# EAGLE design Kortex_Agro (EAGLE 9.3.0)

## Sheet 1 of 2
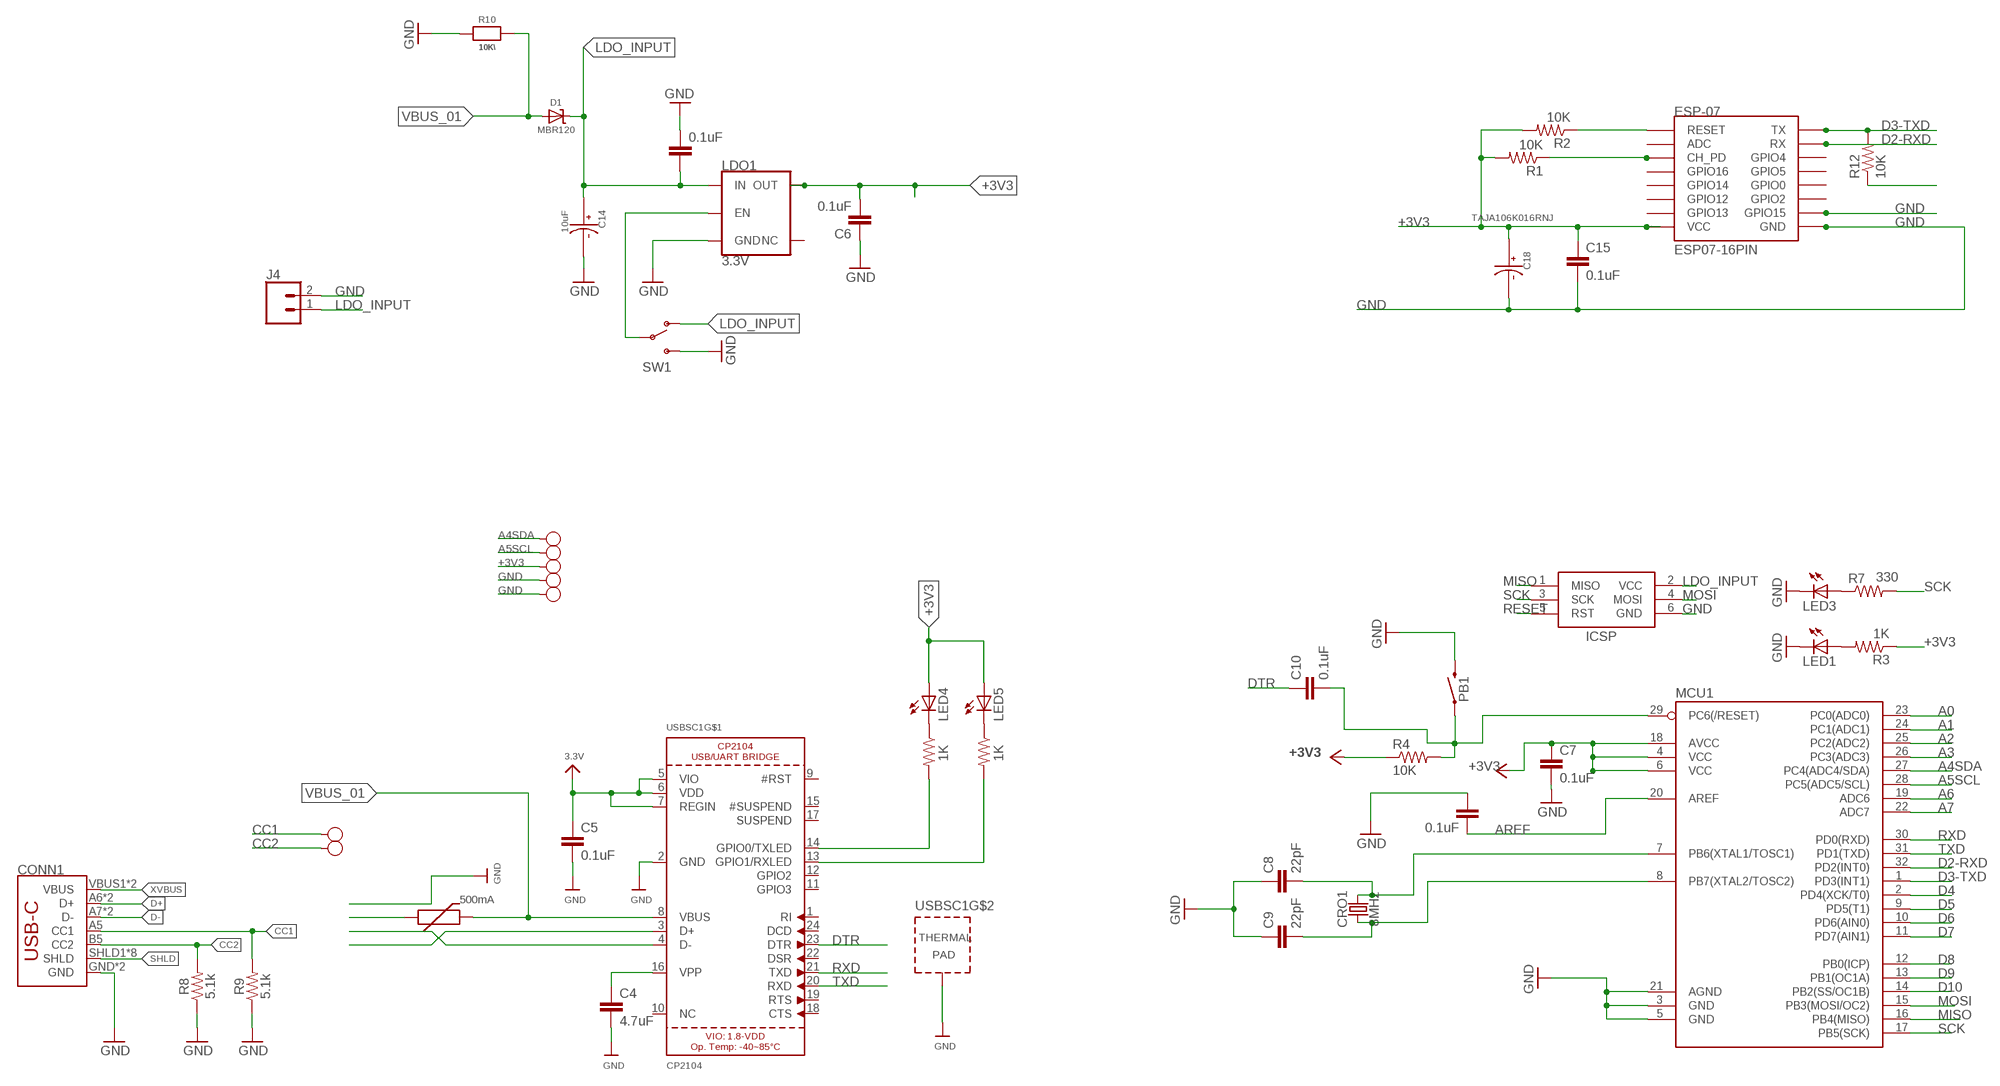
[diagram p0: schematic, sheet 1, part 1 of 2]
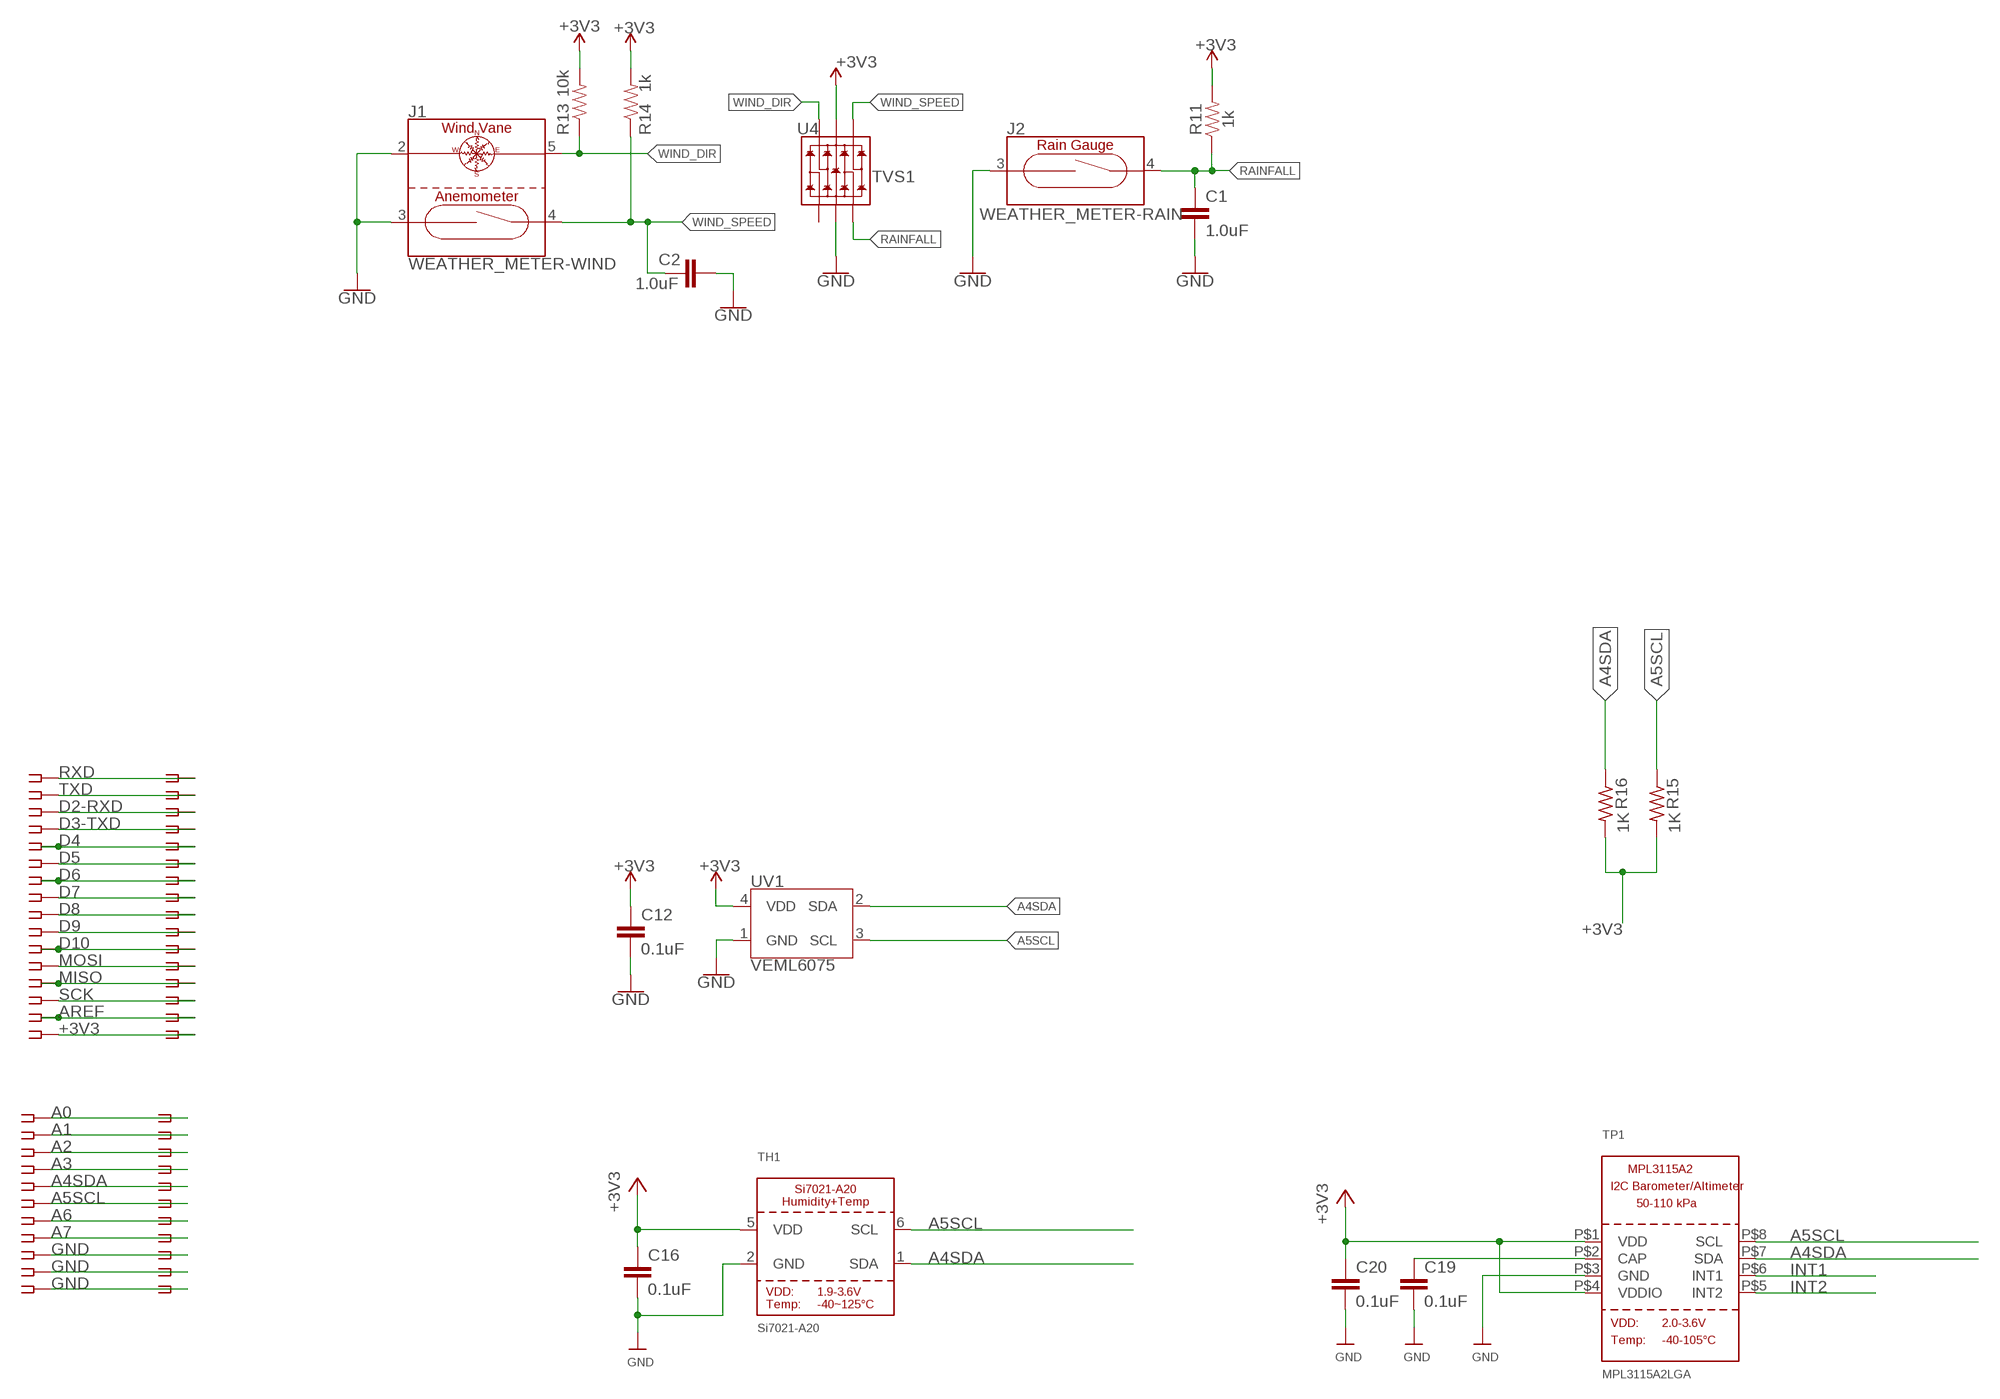
[diagram p1: schematic, sheet 1, part 2 of 2]

### Parts
+3.3V  +3V3  TEST-POINT'4545'  [TP-D45MIL]
C1  1.0uF  1.0UF-0603-16V-10%  [0603]
C2  1.0uF  1.0UF-0603-16V-10%  [0603]
C3  0.1uF  22UF-0805-6.3V-20%  [0805]
C4  4.7uF  22UF-0805-6.3V-20%  [0805]
C5  0.1uF  22UF-0805-6.3V-20%  [0805]
C6  0.1uF  22UF-0805-6.3V-20%  [0805]
C7  0.1uF  22UF-0805-6.3V-20%  [0805]
C8  22pF  22UF-0805-6.3V-20%  [0805]
C9  22pF  22UF-0805-6.3V-20%  [0805]
C10  0.1uF  22UF-0805-6.3V-20%  [0805]
C11  0.1uF  22UF-0805-6.3V-20%  [0805]
C12  0.1uF  0.1UF-0603-25V-(+80/-20%)  [0603]
C14  10uF  TAJA106K016RNJ  [CAPMP3216X166]
C15  0.1uF  CAP0805  [0805]
C16  0.1uF  CAP0805  [0805]
C18  TAJA106K016RNJ  [CAPMP3216X166]
C19  0.1uF  CAP0805  [0805]
C20  0.1uF  CAP0805  [0805]
CONN1  USB_C16PIN  [USB-C-16P]
CRO1  8MHz  CRYSTAL-8MHZSMD-5X3.2  [CRYSTAL-SMD-5X3.2-4PAD]
D1  MBR120  DIODE-SCHOTTKYSOD-123  [SOD-123]
ESP-07  ESP07-16PIN  [ESP07-16PIN]
GND  GND  TEST-POINT'4545'  [TP-D45MIL]
GND13  GND  TEST-POINT'4545'  [TP-D45MIL]
GND21  GND  TEST-POINT'4545'  [TP-D45MIL]
GND22  GND  TEST-POINT'4545'  [TP-D45MIL]
HD1  SSW-116-02-G-D  [SSW-116-02-G-D]
HD2  SSW-111-02-S-D  [SSW-111-02-S-D]
ICSP  AVRISP-6  [AVRISP]
J1  WEATHER_METER-WIND  [RJ11-6]
J2  WEATHER_METER-RAIN  [RJ11-6]
J4  CONN_02  [1X02]
LDO1  3.3V  V_REG_AP2112K-3.3V  [SOT23-5]
LED1  LEDCHIPLED_0805  [CHIPLED_0805]
LED3  LEDCHIPLED_0805  [CHIPLED_0805]
LED4  LEDCHIPLED_0805  [CHIPLED_0805]
LED5  LEDCHIPLED_0805  [CHIPLED_0805]
MCU1  ATMEGA328P_TQFPATMEGA328P-AU  [QFP80P912X912X120-32]
PB1  SWITCH-MOMENTARY-2SMD  [TACTILE_SWITCH_SMD]
PTC1  500mA  PTCSMD  [PTC-1206]
R1  10K  R-US_M0805  [M0805]
R2  10K  R-US_M0805  [M0805]
R3  1K  R-US_M0805  [M0805]
R4  10K  R-US_M0805  [M0805]
R5  1K  R-US_M0805  [M0805]
R6  1K  R-US_M0805  [M0805]
R7  330  R-US_M0805  [M0805]
R8  5.1k  5.1KOHM5.1KOHM-0603-1/10W-1%  [0603]
R9  5.1k  5.1KOHM5.1KOHM-0603-1/10W-1%  [0603]
R10  10K\  RESISTOR0805_NOOUTLINE  [0805-NO]
R11  1k  1KOHM-0603-1/10W-1%  [0603]
R12  10K  R-US_M0805  [M0805]
R13  10k  10KOHM-0603-1/10W-1%  [0603]
R14  1k  1KOHM-0603-1/10W-1%  [0603]
R15  1K  R-US_M0805  [M0805]
R16  1K  R-US_M0805  [M0805]
SCL  SCL  TEST-POINT'4545'  [TP-D45MIL]
SDA  SDA  TEST-POINT'4545'  [TP-D45MIL]
SW1  SWITCH-SPSTSMD  [AYZ0202]
TH1  Si7021-A20  SI7021-A20  [DFN6_3X3_SI]
TP1  MPL3115A2LGA  [LGA8]
U4  TVS1  TVS_DIODE_ARRAYSMD  [SOT-23-6]
USBSC1  CP2104  [QFN24_4MM_SMSC]
UV1  VEML6075  [VEML6075_A3OP]

### Nets
+3V3: +3.3V.T C5.1 C6.2 C7.1 C12.1 C15.1 C16.1 C18.+ C20.1 ESP-07.VCC HD1.31 HD1.32 LDO1.5(OUT) LED4.A LED5.A MCU1.4(VCC) MCU1.6(VCC) MCU1.18(AVCC) R1.2 R2.2 R3.1 R4.1 R11.2 R13.2 R14.2 R15.2 R16.2 TH1.5(VDD) TP1.P$1(VDD) TP1.P$4(VDDIO) U4.5(VCC) USBSC1.5(VIO) USBSC1.6(VDD) USBSC1.7(REGIN) UV1.4(VDD) ; supply symbol labelled 3.3V, +5V
A0: HD2.1 HD2.2 MCU1.23(PC0(ADC0))
A1: HD2.3 HD2.4 MCU1.24(PC1(ADC1))
A2: HD2.5 HD2.6 MCU1.25(PC2(ADC2))
A3: HD2.7 HD2.8 MCU1.26(PC3(ADC3))
A4SDA: HD2.9 HD2.10 MCU1.27(PC4(ADC4/SDA)) R16.1 SDA.T TH1.1(SDA) TP1.P$7(SDA) UV1.2(SDA)
A5SCL: HD2.11 HD2.12 MCU1.28(PC5(ADC5/SCL)) R15.1 SCL.T TH1.6(SCL) TP1.P$8(SCL) UV1.3(SCL)
A6: HD2.13 HD2.14 MCU1.19(ADC6)
A7: HD2.15 HD2.16 MCU1.22(ADC7)
AREF: C11.2 HD1.29 HD1.30 MCU1.20(AREF)
CAP1: C19.1 TP1.P$2(CAP)
CC1: CONN1.A5(CC1) GND21.T R9.2
CC2: CONN1.B5(CC2) GND22.T R8.2
D2-RXD: ESP-07.RX HD1.5 HD1.6 MCU1.32(PD2(INT0))
D3-TXD: ESP-07.TX HD1.7 HD1.8 MCU1.1(PD3(INT1)) R12.2
D4: HD1.9 HD1.10 MCU1.2(PD4(XCK/T0))
D5: HD1.11 HD1.12 MCU1.9(PD5(T1))
D6: HD1.13 HD1.14 MCU1.10(PD6(AIN0))
D7: HD1.15 HD1.16 MCU1.11(PD7(AIN1))
D8: HD1.17 HD1.18 MCU1.12(PB0(ICP))
D9: HD1.19 HD1.20 MCU1.13(PB1(OC1A))
D10: HD1.21 HD1.22 MCU1.14(PB2(SS/OC1B))
D+: CONN1.A6(D+) CONN1.B6(D+) USBSC1.3(D+)
D-: CONN1.A7(D-) CONN1.B7(D-) USBSC1.4(D-)
DTR: C10.1 USBSC1.23(DTR)
GND: C1.2 C2.2 C3.1 C4.2 C5.2 C6.1 C7.2 C8.1 C9.1 C11.1 C12.2 C14.- C15.2 C16.2 C18.- C19.2 C20.2 CONN1.GND CONN1.GND2(GND) ESP-07.GND ESP-07.GPIO15 GND13.T GND.T HD2.17 HD2.18 HD2.19 HD2.20 HD2.21 HD2.22 ICSP.6(GND) J1.2(DIR-1) J1.3(ANN-1) J2.3 J4.2 LDO1.2(GND) LED1.C LED3.C MCU1.3(GND) MCU1.5(GND) MCU1.21(AGND) PB1.3 R8.1 R9.1 R10.1 SW1.3(S) TH1.2(GND) TP1.P$3(GND) U4.2(VSS) USBSC1.2(GND) USBSC1.THERM(TP) UV1.1(GND)
GPIO/0: R6.2 USBSC1.14(GPIO0/TXLED)
GPIO/1: R5.2 USBSC1.13(GPIO1/RXLED)
INT1: TP1.P$6(INT1)
INT2: TP1.P$5(INT2)
LDO_INPUT: C3.2 C14.+ D1.C ICSP.2(VCC) J4.1 LDO1.1(IN) SW1.1(O)
MISO: HD1.25 HD1.26 ICSP.1(MISO) MCU1.16(PB4(MISO))
MOSI: HD1.23 HD1.24 ICSP.4(MOSI) MCU1.15(PB3(MOSI/OC2))
N$1: LED3.A R7.1
N$2: LED1.A R3.2
N$3: ESP-07.CH_PD R1.1
N$5: LED4.C R6.1
N$6: C9.2 CRO1.1 MCU1.8(PB7(XTAL2/TOSC2))
N$7: C8.2 CRO1.3 MCU1.7(PB6(XTAL1/TOSC1))
N$8: LED5.C R5.1
N$10: ESP-07.REST(RESET) R2.1
N$13: C4.1 USBSC1.16(VPP)
N$16: LDO1.3(EN) SW1.2(P)
PPP: R12.1
RAINFALL: C1.1 J2.4 R11.1 U4.3(IO2)
RESET: C10.2 ICSP.5(RST) MCU1.29(PC6(/RESET)) PB1.1 R4.2
RXD: HD1.1 HD1.2 MCU1.30(PD0(RXD)) USBSC1.21(TXD)
SCK: HD1.27 HD1.28 ICSP.3(SCK) MCU1.17(PB5(SCK)) R7.2
SHLD: CONN1.SHLD1(SHLD) CONN1.SHLD2(SHLD) CONN1.SHLD3(SHLD) CONN1.SHLD4(SHLD) CONN1.SHLD5(SHLD) CONN1.SHLD6(SHLD) CONN1.SHLD7(SHLD) CONN1.SHLD8(SHLD)
TXD: HD1.3 HD1.4 MCU1.31(PD1(TXD)) USBSC1.20(RXD)
VBUS_01: D1.A PTC1.2 R10.2 USBSC1.8(VBUS)
WIND_DIR: J1.5(DIR2) R13.1 U4.6(IO4)
WIND_SPEED: C2.1 J1.4(ANN-2) R14.1 U4.4(IO3)
XVBUS: CONN1.VBUS1(VBUS) CONN1.VBUS2(VBUS) PTC1.1
Unconnected: ESP-07.ADC ESP-07.GPIO0 ESP-07.GPIO2 ESP-07.GPIO4 ESP-07.GPIO5 ESP-07.GPIO12 ESP-07.GPIO13 ESP-07.GPIO14 ESP-07.GPIO16 LDO1.4(NC) U4.1(IO1) USBSC1.1(RI) USBSC1.9(#RST) USBSC1.10(NC) USBSC1.11(GPIO3) USBSC1.12(GPIO2) USBSC1.15(#SUSPEND) USBSC1.17(SUSPEND) USBSC1.18(CTS) USBSC1.19(RTS) USBSC1.22(DSR) USBSC1.24(DCD)

### Notes on the sheet
- -LLC:
- -USB/SERIAL:
- -5V.REG:
- -3.3V.REG:
- -OPAMP:
- -USB-CONN:
- -PWR.CONN:
- 500mA

## Sheet 2 of 2

## Library data of the parts
+3.3V GND GND13 GND21 GND22 SCL SDA = Discrete-new:TEST-POINT; PARTNO: DNP
C1 C2 = SparkFun-Capacitors:1.0UF: 1µF ceramic capacitors A capacitor is a passive two-terminal electrical component used to store electrical energy temporarily in an electric field.; PROD_ID: CAP-00868
C3-C11 = SparkFun-Capacitors:22UF: 22µF ceramic capacitors A capacitor is a passive two-terminal electrical component used to store electrical energy temporarily in an electric field.; PROD_ID: CAP-08402; VALUE: 22uF
C12 = SparkFun-Capacitors:0.1UF: 0.1µF ceramic capacitors A capacitor is a passive two-terminal electrical component used to store electrical energy temporarily in an electric field.; PROD_ID: CAP-00810
C14 C18 = TAJA106K016RNJ:TAJA106K016RNJ: Cap Tant Solid 10uF 16V A CASE 10% (3.2 X 1.6 X 1.6mm) SMD 3216-18 3 Ohm 125°C T/R; AVAILABILITY: Good; DESCRIPTION: Cap Tant Solid 10uF 16V A CASE 10% (3.2 X 1.6 X 1.6mm) SMD 3216-18 3 Ohm 125°C T/R; MF: AVX Interconnect / Elco; MP: TAJA106K016RNJ; PACKAGE: 1206 AVX Interconnect / Elco; PRICE: 0.16 USD
C15 = SparkFun:CAP: Capacitor Standard 0603 ceramic capacitor, and 0.1" leaded capacitor.
C16 C19 C20 = SparkFun-Passives:CAP: Capacitor Standard 0603 ceramic capacitor, and 0.1" leaded capacitor.
CONN1 = SparkFun-Connectors:USB_C: USB Type C 16Pin Connector Super Speed pins not available on the 16-pin purely SMD connector so this part is best for USB 2.0 implementations. D1 and D2 are tied together enabling D+/- no matter which way the cable is plugged into the connector. The two channel configuration pins (CC1/2) are exposed. These are normally connected to ground via 5.1k resistors but can be reconfigured for high current/high power applications.; PROD_ID: CONN-14122
CRO1 = SparkFun-Clocks:CRYSTAL-8MHZ: 8MHz Crystal Datasheet Example <http://www.futureelectronics.com/en/technologies/electromechanical/timing-devices/crystals/Pages/6008189-ABM3B-8.000MHZ-B2-T.aspx?IM=0> Frequency: 8MHz Frequency Tolerance: ±20ppm Load Capacitance: 18pF SparkFun Products: Pro Micro -3.3V/8MHz <https://www.sparkfun.com/products/12587> WAV Trigger <https://www.sparkfun.com/products/13660>; PROD_ID: XTAL-09431
D1 = microbuilder:DIODE-SCHOTTKY
ESP-07 = esp8266modules:ESP07-16PIN: ESP8266 Wifi module 07 - 16 pins; DIMENSIONS: 22.0 x 16.0 mm; PINS: 16; PITCH: 0.078" / 2 mm
HD1 = con-samtec:SSW-116-02-G: THROUGH-HOLE .025" SQ POST SOCKET Source: Samtec SSW.pdf; MF: Samtec Inc.; MPN: SSW-116-02-G-D; OC_FARNELL: unknown; OC_NEWARK: 11P9577
HD2 = con-samtec:SSW-111-02-S-D: THROUGH-HOLE .025" SQ POST SOCKET Source: Samtec SSW.pdf; MPN: SSW-111-02-S-D; OC_FARNELL: unknown; OC_NEWARK: 11P9496
ICSP = adafruit:AVRISP: AVR ISP HEADER Standard 6 pin header for AVR programming
J1 = esp32-environ-monitor-temp:WEATHER_METER-WIND: RJ11 Jack - 6 pin Commonly found on CAT3 devices and some Microchip programmers. Here is the connector we sell at SparkFun: RJ11 6-Pin Connector <https://www.sparkfun.com/products/132> (PRT-00132) Datasheet <http://www.sparkfun.com/datasheets/Prototyping/Connectors/RJ11-Datasheet.pdf> It is used on this SparkFun product: SparkFun Weather Shield <https://www.sparkfun.com/products/12081> (DEV-12081) Weather Meters <https://www.sparkfun.com/products/8942> (SEN-08942); PROD_ID: CONN-08590; SF_ID: PRT-00132
J2 = esp32-environ-monitor-temp:WEATHER_METER-RAIN: Weather Meter - Rain Gauge Symbol The rain half of the SparkFun Weather Meter <https://www.sparkfun.com/products/8942>. The rain gauge is a self-emptying tipping bucket type. Each 0.011” (0.2794 mm) of rain causes one momentary contact closure that can be recorded with a digital counter or microcontroller interrupt input. The gauge’s switch is connected to the two center conductors of the attached RJ11-terminated cable. Datasheet <http://www.sparkfun.com/datasheets/Sensors/Weather/Weather%20Sensor%20Assembly..pdf> Here is the connector we sell at SparkFun: RJ11 6-Pin Connector <https://www.sparkfun.com/products/132> (PRT-00132) Datasheet <http://www.sparkfun.com/datasheets/Prototyping/Connectors/RJ11-Datasheet.pdf> It is used on this SparkFun product: SparkFun Weather Shield <https://www.sparkfun.com/products/12081> (DEV-12081) Weather Meters <https://www.sparkfun.com/products/8942> (SEN-08942); PROD_ID: CONN-08590; SF_ID: SEN-08942
J4 = SparkFun-Connectors:CONN_02: Multi connection point. Often used as Generic Header-pin footprint for 0.1 inch spaced/style header connections On any of the 0.1 inch spaced packages, you can populate with these: Break Away Headers - Straight <https://www.sparkfun.com/products/116> (PRT-00116) Break Away Male Headers - Right Angle <https://www.sparkfun.com/products/553> (PRT-00553) Female Headers <https://www.sparkfun.com/products/115> (PRT-00115) Break Away Headers - Machine Pin <https://www.sparkfun.com/products/117> (PRT-00117) Break Away Female Headers - Swiss Machine Pin <https://www.sparkfun.com/products/743> (PRT-00743) For SCREWTERMINALS and SPRING TERMINALS visit here: Screw Terimnals on SparkFun.com <https://www.sparkfun.com/search/results?term=Screw+Terminals> (5mm/3.5mm/2.54mm spacing) This device is also useful as a general connection point to wire up your design to another part of your project. Our various solder wires solder well into these plated through hole pads. Hook-Up Wire - Assortment (Stranded, 22 AWG) <https://www.sparkfun.com/products/11375> (PRT-11375) Hook-Up Wire - Assortment (Solid Core, 22 AWG) <https://www.sparkfun.com/products/11367> (PRT-11367) View the entire wire category on our website here <https://www.sparkfun.com/categories/141> Special notes: Molex polarized connector foot print use with: PRT-08233 with associated crimp pins and housings. 2.54_SCREWTERM for use with PRT-10571. 3.5mm Screw Terminal footprints for PRT-08084 5mm Screw Terminal footprints for use with PRT-08432
LDO1 = SparkFun-IC-Power:V_REG_AP2112: AP2112 - 600mA CMOS LDO Regulator w/ Enable The AP2112 is CMOS process low dropout linear regulator with enable function, the regulator delivers a guaranteed 600mA (min.) continuous load current. Features Output Voltage Accuracy: ±1.5% Output Current: 600mA (Min.) Foldback Short Current Protection: 50mA Enable Function to Turn ON/OFF VOUT Low Dropout Voltage (3.3V): 250mV (Typ.) @IOUT=600mA Excellent Load Regulation: 0.2%/A (Typ.) Excellent Line Regulation: 0.02%/V (Typ.) Low Quiescent Current: 55μA (Typ.) Low Standby Current: 0.01μA (Typ.) Low Output Noise: 50μVRMS PSRR: 100Hz -65dB, 1kHz -65dB OTSD Protection Stable with 1.0μF Flexible Cap: Ceramic, Tantalum and Aluminum Electrolytic Operation Temperature Range: -40°C to 85°C ESD: MM 400V, HBM 4000V; PROD_ID: VREG-12457
LED1 LED3-LED5 = adafruit:LED: LED OSRAM: - CHIPLED LG R971, LG N971, LY N971, LG Q971, LY Q971, LO R971, LY R971 LH N974, LH R974 LS Q976, LO Q976, LY Q976 LO Q996 - Hyper CHIPLED LW Q18S LB Q993, LB Q99A, LB R99A - SideLED LS A670, LO A670, LY A670, LG A670, LP A670 LB A673, LV A673, LT A673, LW A673 LH A674 LY A675 LS A676, LA A676, LO A676, LY A676, LW A676 LS A679, LY A679, LG A679 - Hyper Micro SIDELED® LS Y876, LA Y876, LO Y876, LY Y876 LT Y87S - SmartLED LW L88C, LW L88S LB L89C, LB L89S, LG L890 LS L89K, LO L89K, LY L89K LS L896, LA L896, LO L896, LY L896 - TOPLED LS T670, LO T670, LY T670, LG T670, LP T670 LSG T670, LSP T670, LSY T670, LOP T670, LYG T670 LG T671, LOG T671, LSG T671 LB T673, LV T673, LT T673, LW T673 LH T674 LS T676, LA T676, LO T676, LY T676, LB T676, LH T676, LSB T676, LW T676 LB T67C, LV T67C, LT T67C, LS T67K, LO T67K, LY T67K, LW E67C LS E67B, LA E67B, LO E67B, LY E67B, LB E67C, LV E67C, LT E67C LW T67C LS T679, LY T679, LG T679 LS T770, LO T770, LY T770, LG T770, LP T770 LB T773, LV T773, LT T773, LW T773 LH T774 LS E675, LA E675, LY E675, LS T675 LS T776, LA T776, LO T776, LY T776, LB T776 LHGB T686 LT T68C, LB T68C - Hyper Mini TOPLED® LB M676 - Mini TOPLED Santana® LG M470 LS M47K, LO M47K, LY M47K Source: http://www.osram.convergy.de/
MCU1 = ATMEGA328P-AU:ATMEGA328P_TQFP: Popular 328P in QFP Storefront component: ATmega328 - TQFP <https://www.sparkfun.com/products/13448> (COM-13448) Datasheet <http://www.sparkfun.com/datasheets/Components/SMD/ATMega328.pdf> SparkFun Products SparkFun RedBoard - Programmed with Arduino <https://www.sparkfun.com/products/12757> (DEV-12757) Arduino Pro Mini 328 - 5V/16MHz <https://www.sparkfun.com/products/11113> (DEV-11113) Arduino Pro Mini 328 - 3.3V/8MHz <https://www.sparkfun.com/products/11114> (DEV-11114) SparkFun OpenLog <https://www.sparkfun.com/products/13712> (DEV-13712) SparkFun MicroView - OLED Arduino Module <https://www.sparkfun.com/products/12923> (DEV-12923) SparkFun Digital Sandbox <https://www.sparkfun.com/products/12651> (DEV-12651) SparkFun PicoBoard <https://www.sparkfun.com/products/11888> (WIG-11888) Arduino Fio <https://www.sparkfun.com/products/10116> (DEV-10116) LilyPad Arduino 328 Main Board <https://www.sparkfun.com/products/13342> (DEV-13342) SparkFun RedStick <https://www.sparkfun.com/products/13741> (DEV-13741) LilyPad MP3 <https://www.sparkfun.com/products/11013> (DEV-11013) LilyPad Arduino SimpleSnap <https://www.sparkfun.com/products/10941> (DEV-10941) SparkFun Stepoko <https://www.sparkfun.com/products/13899> (ROB-13899) SparkFun Geiger Counter <https://www.sparkfun.com/products/11345> (SEN-11345) SparkFun EL Sequencer <https://www.sparkfun.com/products/12781> (COM-12781) Arduino Pro 328 - 5V/16MHz <https://www.sparkfun.com/products/10915> (DEV-10915) CryptoCape <https://www.sparkfun.com/products/12773> (DEV-12773) SparkFun IR Thermometer Evaluation Board - MLX90614 <https://www.sparkfun.com/products/10740> (SEN-10740) SparkFun RedBot Mainboard <https://www.sparkfun.com/products/12097> (ROB-12097) Arduino Pro 328 - 3.3V/8MHz <https://www.sparkfun.com/products/10914> (DEV-10914) SparkFun Block for Intel® Edison - Arduino <https://www.sparkfun.com/products/13036> (DEV-13036) SparkFun Simon Says - Surface Mount Soldering Kit <https://www.sparkfun.com/products/10935> (KIT-10935) SparkFun 7-Segment Serial Display - Red <https://www.sparkfun.com/products/11441> (COM-11441) SparkFun 7-Segment Serial Display - White <https://www.sparkfun.com/products/11629> (COM-11629) SparkFun 7-Segment Serial Display - Yellow <https://www.sparkfun.com/products/11443> (COM-11443) SparkFun 7-Segment Serial Display - Kelly Green <https://www.sparkfun.com/products/11440> (COM-11440) SparkFun 7-Segment Serial Display - Blue <https://www.sparkfun.com/products/11442> (COM-11442) SparkFun OpenSegment Serial Display - 20mm (Blue) <https://www.sparkfun.com/products/11647> (COM-11647) SparkFun OpenSegment Serial Display - 20mm (Green) <https://www.sparkfun.com/products/11646> (COM-11646) SparkFun OpenSegment Serial Display - 20mm (White) <https://www.sparkfun.com/products/11648> (COM-11648) SparkFun OpenSegment Serial Display - 20mm (Red) <https://www.sparkfun.com/products/11644> (COM-11644) SparkFun OpenSegment Serial Display - 20mm (Yellow) <https://www.sparkfun.com/products/11645> (COM-11645) SparkFun OpenSegment Shield <https://www.sparkfun.com/products/13190> (DEV-13190)
PB1 = SparkFun-Electromechanical:SWITCH-MOMENTARY-2: Various NO switches- pushbuttons, reed, etc
PTC1 = SparkFun:PTC: Resettable Fuse PTC Resettable Fuse. Spark Fun Electronics SKU : COM-08357
R1 R2 R12 = resistor:R-US_: RESISTOR, American symbol
R3-R7 R15 R16 = adafruit:R-US_: RESISTOR, American symbol
R8 R9 = SparkFun-Resistors:5.1KOHM; PROD_ID: RES-12083
R10 = microbuilder:RESISTOR: Resistors For new designs, use the packages preceded by an '_' character since they are more reliable: The following footprints should be used on most boards: _0402 - Standard footprint for regular board layouts _0603 - Standard footprint for regular board layouts _0805 - Standard footprint for regular board layouts _1206 - Standard footprint for regular board layouts For extremely tight-pitch boards where space is at a premium, the following 'micro-pitch' footprints can be used (smaller pads, no silkscreen outline, etc.): _0402MP - Micro-pitch footprint for very dense/compact boards _0603MP - Micro-pitch footprint for very dense/compact boards _0805MP - Micro-pitch footprint for very dense/compact boards _1206MP - Micro-pitch footprint for very dense/compact boards
R11 R14 = SparkFun-Resistors:1KOHM: 1kΩ resistor A resistor is a passive two-terminal electrical component that implements electrical resistance as a circuit element. Resistors act to reduce current flow, and, at the same time, act to lower voltage levels within circuits. - Wikipedia; PROD_ID: RES-07856
R13 = SparkFun-Resistors:10KOHM: 10kΩ resistor A resistor is a passive two-terminal electrical component that implements electrical resistance as a circuit element. Resistors act to reduce current flow, and, at the same time, act to lower voltage levels within circuits. - Wikipedia; PROD_ID: RES-00824
SW1 = SparkFun:SWITCH-SPST: SPST Switch Simple slide switch. Spark Fun Electronics SKU : COM-00102
TH1 = microbuilder:SI7021-A20: Si7021-A20 - I2C Humidity and Temperature Sensor VDD: 1.9-3.6V Operating Temperature: -40~125°C +/-3% RH (max) 0..80% RH Humidity Sensor +/-0.4°C (max-, -10~85°C Temperature Sensor 150uA Active, 60nA Standby
TP1 = microbuilder:MPL3115A2
U4 = esp32-environ-monitor-temp:TVS_DIODE_ARRAY; PROD_ID: IC-13538; VALUE: ESD Diode
USBSC1 = microbuilder:CP2104: CP2104 - USB to UART Bridge VDD Output: 3.45V; SPICEPREFIX: X
UV1 = SparkFun-Sensors:VEML6075: Vishay VEML6075 UVA and UVB light sensor with I2C interface.; PROD_ID: IC-14149

## Net classes
1 power: width 0.178 mm

## Board
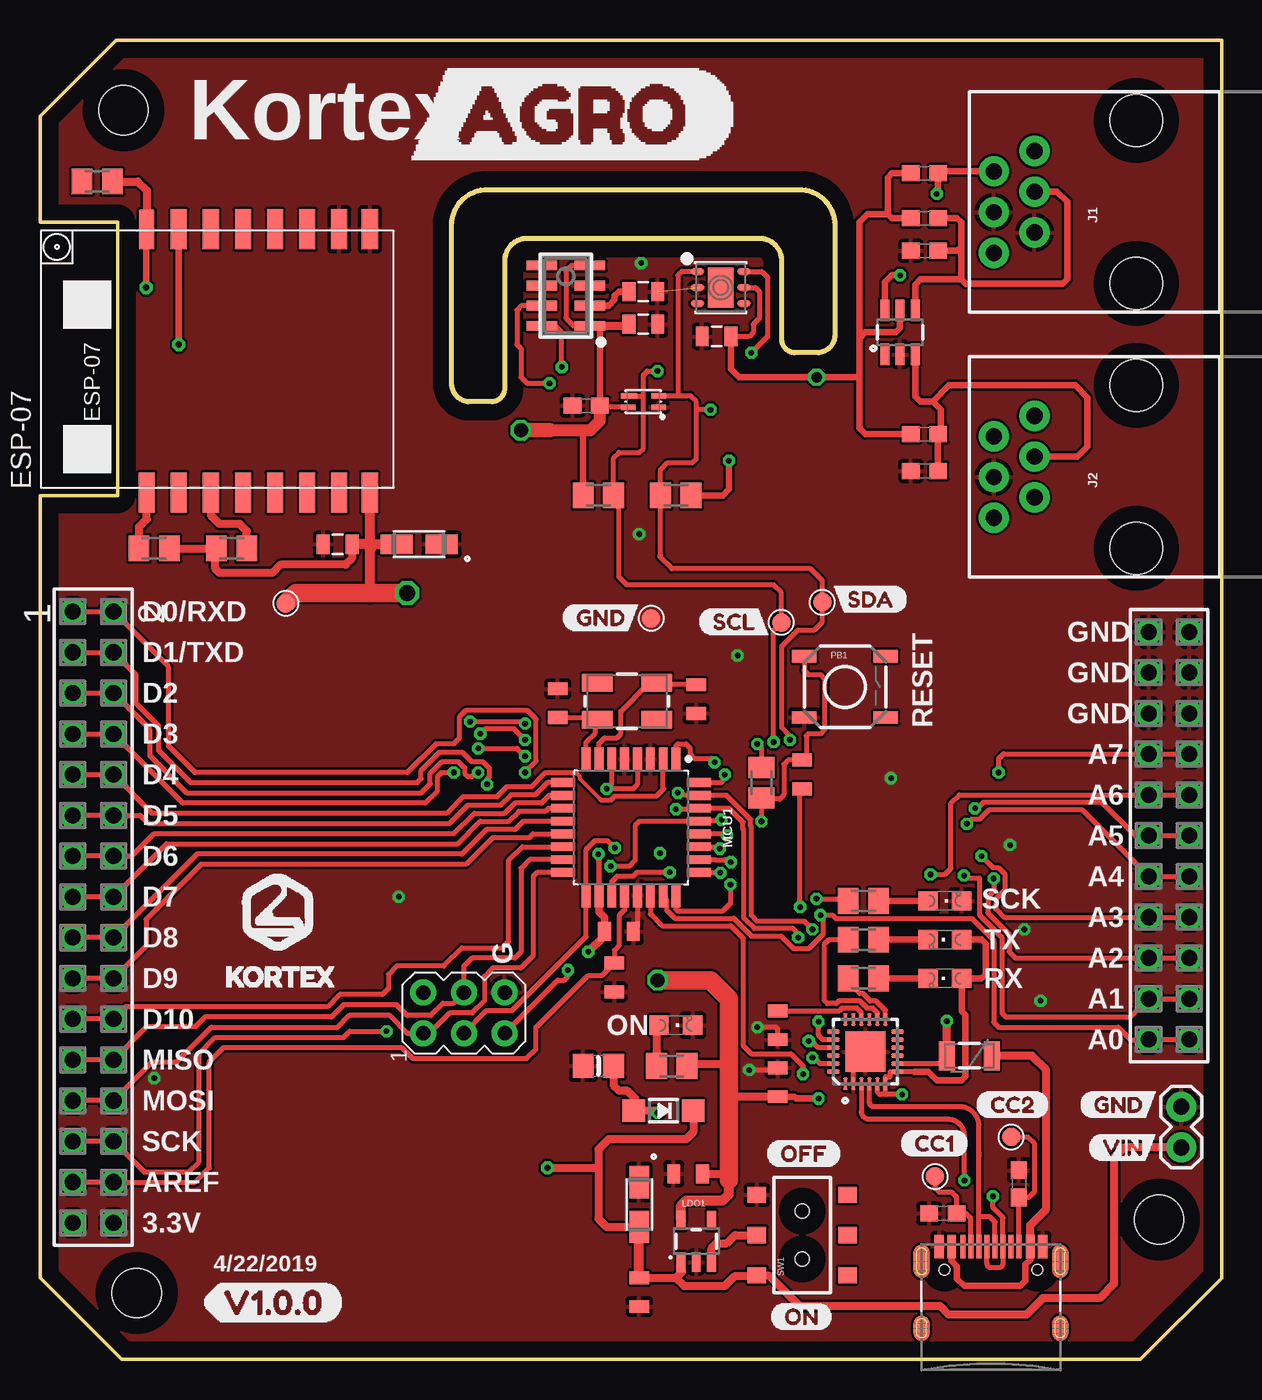
[diagram p2: board, top side]
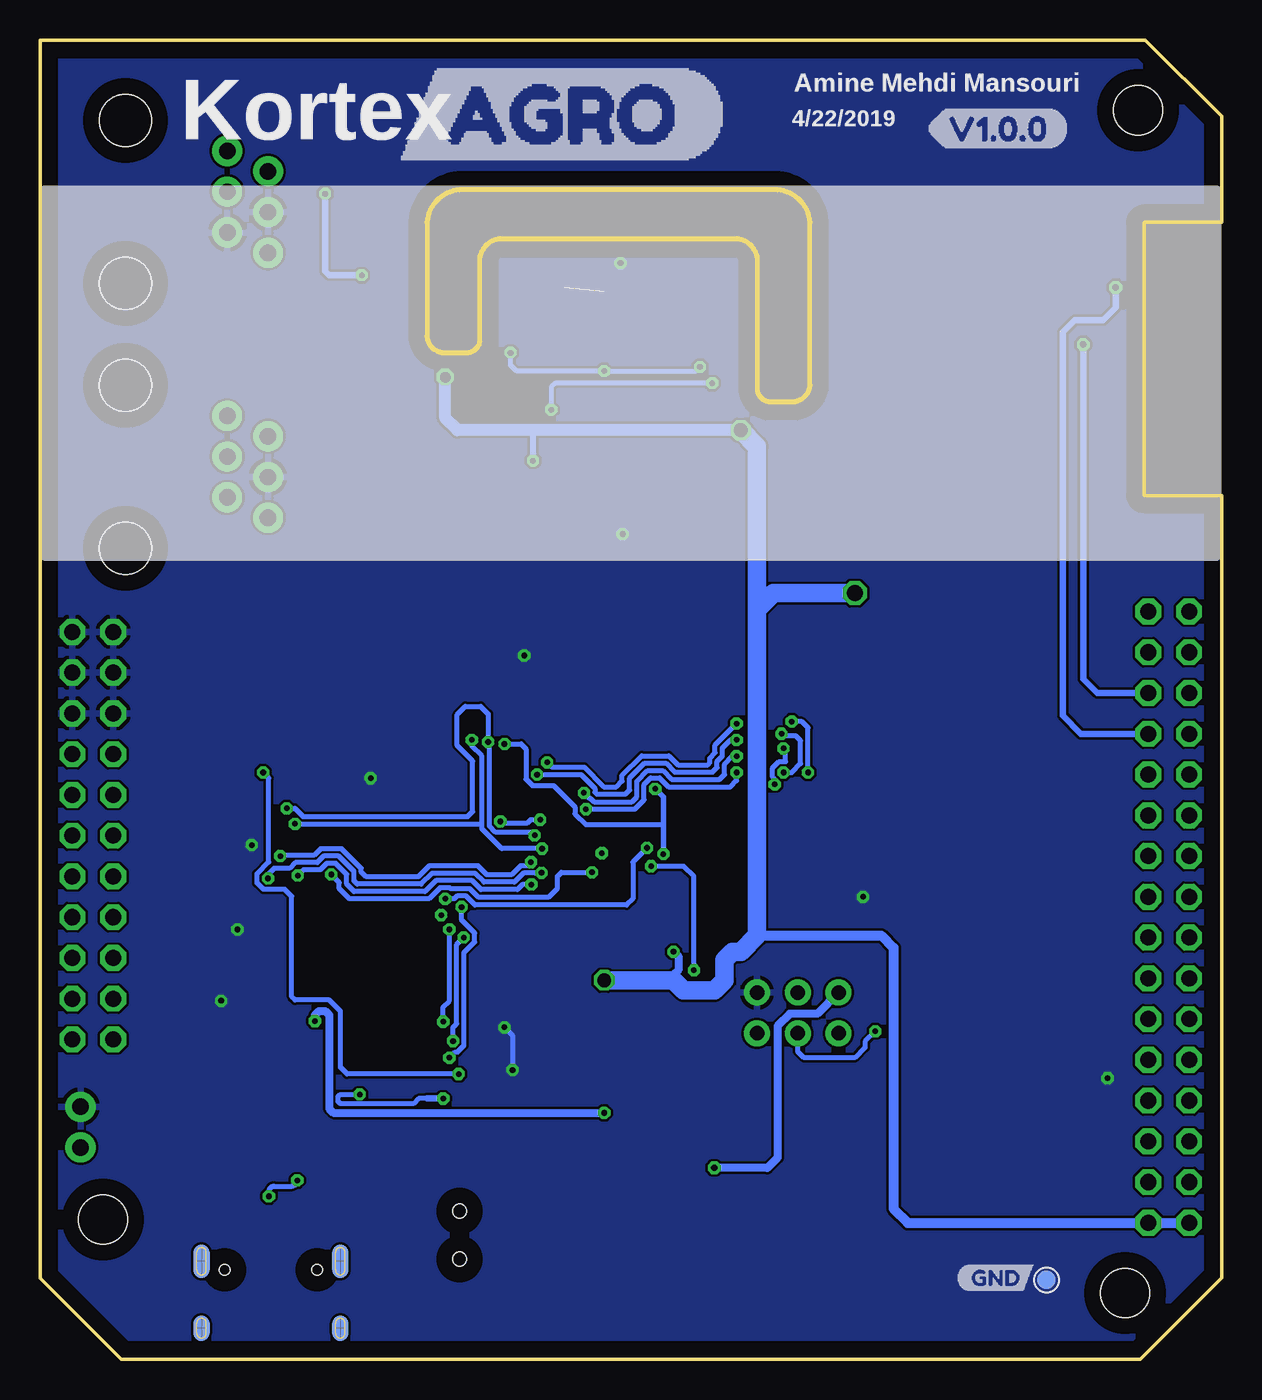
[diagram p3: board, bottom side, seen from below]

Size 73.64 x 82.22 mm. Coordinates in mm from the lower left corner, seen from the top.
Outline: 0,77.47 0,70.87 4.83,70.87 4.83,53.85 0,53.85 0,5.08 5.08,0 68.58,0 73.64,5.06 73.64,82.22 4.75,82.22 0,77.47
Outline: 48.51,62.74 46.99,62.74 arc-80 46.23,63.5 46.23,68.58 arc80 44.96,69.85 30.23,69.85 arc80 28.96,68.58 28.96,60.45 arc-80 28.19,59.69 26.67,59.69 arc-80 25.65,60.71 25.65,70.87 arc-80 27.69,72.9 47.5,72.9 arc-80 49.53,70.87 49.53,63.75 arc-80 48.51,62.74
Copper layers (1*16): Top 0.035mm / dielectric 1.5mm / Bottom 0.035mm
Design rules "default *": minimum track width 6mil, minimum drill 0.35mm, track to track 6mil, track to pad 6mil, pad to pad 6mil, via to via 6mil, smd to smd 6mil, copper to edge 40mil, drill to drill 6mil, minimum pad ring 12mil, minimum via ring 8mil, stop-mask expansion 4mil, vias tented up to drill 14mil, thermal gap 10mil
Holes 3.05 mm at 6.02,4.14 69.72,8.71 5.21,77.85

### Footprints (pad centres in the part's own frame; a part is rotated, then mirrored left to right if it is on the bottom)
TP-D45MIL = smd 1.143 x 1.143: T 0,0
0603 = smd 1.1 x 1: 1 -0.85,0; 2 0.85,0
0805 = smd 0.8 x 1.2: 1 -0.9,0; 2 0.9,0
CAPMP3216X166 = smd 2 x 1.2: + 1.4,0; - -1.4,0
USB-C-16P = smd 0.3 x 1.45: A5 -1.25,0; A6 -0.25,0; A7 0.25,0; A8 1.25,0; B5 1.75,0; B6 0.75,0; B7 -0.75,0; B8 -1.75,0 | smd 0.6 x 1.45: GND -3.225,0; GND2 3.225,0 | smd 1 x 2.1: SHLD1 -4.32,-0.915; SHLD2 4.32,-0.915 | smd 1 x 2.1 bottom: SHLD3 -4.32,-0.915; SHLD4 4.32,-0.915 | smd 1 x 1.6: SHLD5 -4.32,-5.095; SHLD8 4.32,-5.095 | smd 1 x 1.6 bottom: SHLD6 -4.32,-5.095; SHLD7 4.32,-5.095 | smd 0.55 x 1.45: VBUS1 -2.45,0; VBUS2 2.45,0 | hole 0.65: -2.89,-1.445; 2.89,-1.445
CRYSTAL-SMD-5X3.2-4PAD = smd 1.9 x 1.1: 1 -1.85,-1.15; 2 1.85,-1.15; 3 1.85,1.15; 4 -1.85,1.15
SOD-123 = smd 1.4 x 1.4: A 1.85,0; C -1.85,0
ESP07-16PIN = smd 2.5 x 1: ADC -8.2,3.8; CH_PD -8.2,1.8; GND 8.2,-8.105; GPIO0 8.2,-2.2; GPIO2 8.2,-4.2; GPIO4 8.2,1.8; GPIO5 8.2,-0.2; GPIO12 -8.2,-4.2; GPIO13 -8.2,-6.2; GPIO14 -8.2,-2.2; GPIO15 8.2,-6.2; GPIO16 -8.2,-0.2; REST -8.2,5.8; RX 8.2,3.8; TX 8.2,5.8; VCC -8.2,-8.105
SSW-116-02-G-D = drill 1 pad 1.5 octagon: 1 -19.05,-1.27; 2 -19.05,1.27; 3 -16.51,-1.27; 4 -16.51,1.27; 5 -13.97,-1.27; 6 -13.97,1.27; 7 -11.43,-1.27; 8 -11.43,1.27; 9 -8.89,-1.27; 10 -8.89,1.27; 11 -6.35,-1.27; 12 -6.35,1.27; 13 -3.81,-1.27; 14 -3.81,1.27; 15 -1.27,-1.27; 16 -1.27,1.27; 17 1.27,-1.27; 18 1.27,1.27; 19 3.81,-1.27; 20 3.81,1.27; 21 6.35,-1.27; 22 6.35,1.27; 23 8.89,-1.27; 24 8.89,1.27; 25 11.43,-1.27; 26 11.43,1.27; 27 13.97,-1.27; 28 13.97,1.27; 29 16.51,-1.27; 30 16.51,1.27; 31 19.05,-1.27; 32 19.05,1.27
SSW-111-02-S-D = drill 1 pad 1.5 octagon: 1 -12.7,-1.27; 2 -12.7,1.27; 3 -10.16,-1.27; 4 -10.16,1.27; 5 -7.62,-1.27; 6 -7.62,1.27; 7 -5.08,-1.27; 8 -5.08,1.27; 9 -2.54,-1.27; 10 -2.54,1.27; 11 0,-1.27; 12 0,1.27; 13 2.54,-1.27; 14 2.54,1.27; 15 5.08,-1.27; 16 5.08,1.27; 17 7.62,-1.27; 18 7.62,1.27; 19 10.16,-1.27; 20 10.16,1.27; 21 12.7,-1.27; 22 12.7,1.27
AVRISP = drill 0.9 pad 1.626: 1 -1.27,2.54; 2 1.27,2.54; 3 -1.27,0; 4 1.27,0; 5 -1.27,-2.54; 6 1.27,-2.54
RJ11-6 = drill 1.016 pad 1.88: 1 -3.175,8.89; 2 -1.905,6.35; 3 -0.635,8.89; 4 0.635,6.35; 5 1.905,8.89; 6 3.175,6.35 | hole 3.251: -5.08,0; 5.08,0
1X02 = drill 1.016 pad 1.88: 1 0,0; 2 2.54,0
SOT23-5 = smd 0.55 x 1.2: 1 -0.95,-1.3; 2 0,-1.3; 3 0.95,-1.3; 4 0.95,1.3; 5 -0.95,1.3
CHIPLED_0805 = smd 1.2 x 1.2: A 0,-1.05; C 0,1.05
QFP80P912X912X120-32 = smd 1.504 x 0.547: 1 -4.235,2.8; 2 -4.235,2; 3 -4.235,1.2; 4 -4.235,0.4; 5 -4.235,-0.4; 6 -4.235,-1.2; 7 -4.235,-2; 8 -4.235,-2.8; 17 4.235,-2.8; 18 4.235,-2; 19 4.235,-1.2; 20 4.235,-0.4; 21 4.235,0.4; 22 4.235,1.2; 23 4.235,2; 24 4.235,2.8 | smd 0.547 x 1.504: 9 -2.8,-4.235; 10 -2,-4.235; 11 -1.2,-4.235; 12 -0.4,-4.235; 13 0.4,-4.235; 14 1.2,-4.235; 15 2,-4.235; 16 2.8,-4.235; 25 2.8,4.235; 26 2,4.235; 27 1.2,4.235; 28 0.4,4.235; 29 -0.4,4.235; 30 -1.2,4.235; 31 -2,4.235; 32 -2.8,4.235
TACTILE_SWITCH_SMD = smd 1.524 x 0.762: 1 -2.54,1.905; 2 2.54,1.905; 3 -2.54,-1.905; 4 2.54,-1.905
PTC-1206 = smd 1 x 1.8: 1 -1.4,0; 2 1.4,0
M0805 = smd 1.3 x 1.6: 1 -0.95,0; 2 0.95,0
0805-NO = smd 1.3 x 1.5: 1 -0.95,0; 2 0.95,0
AYZ0202 = smd 1 x 1.15: 1 -2.5,2.825; 2 0,2.825; 3 2.5,2.825; 4 -2.5,-2.825; 5 0,-2.825; 6 2.5,-2.825 | hole 0.85: 1.5,0; -1.5,0
DFN6_3X3_SI = smd 0.85 x 0.45: 1 -1.45,1; 2 -1.45,0; 3 -1.45,-1; 4 1.45,-1; 5 1.45,0; 6 1.45,1 | smd 1.6 x 2.5: P$1 0,0
LGA8 = smd 1.9 x 0.6: P$1 -1.5,1.875; P$2 -1.5,0.625; P$3 -1.5,-0.625; P$4 -1.5,-1.875; P$5 1.5,-1.875; P$6 1.5,-0.625; P$7 1.5,0.625; P$8 1.5,1.875
SOT-23-6 = smd 0.55 x 1.35: 1 -0.95,-1.375; 2 0,-1.375; 3 0.95,-1.375; 4 0.95,1.375; 5 0,1.375; 6 -0.95,1.375
QFN24_4MM_SMSC = smd 0.8 x 0.28: 1 -2,1.25; 2 -2,0.75; 3 -2,0.25; 4 -2,-0.25; 5 -2,-0.75; 6 -2,-1.25; 13 2,-1.25; 14 2,-0.75; 15 2,-0.25; 16 2,0.25; 17 2,0.75; 18 2,1.25 | smd 0.28 x 0.8: 7 -1.25,-2; 8 -0.75,-2; 9 -0.25,-2; 10 0.25,-2; 11 0.75,-2; 12 1.25,-2; 19 1.25,2; 20 0.75,2; 21 0.25,2; 22 -0.25,2; 23 -0.75,2; 24 -1.25,2 | smd 2.5 x 2.5: THERM 0,0
VEML6075_A3OP = smd 0.9 x 0.35: 1 -0.95,0.35; 2 -0.95,-0.35; 4 0.95,0.35 | smd 1 x 0.35: 3 0.9,-0.35

### Placement (x,y rotation side)
+3.3V  15.32,47.12 180 top
C1  55.12,55.37 180 top
C2  55.12,69.09 180 top
C3  37.34,4.19 90 top
C4  45.97,20.83 270 top
C5  45.97,17.27 90 top
C6  40.39,11.56 0 top
C7  36.07,26.67 0 top
C8  40.89,41.15 90 top
C9  32.26,40.89 270 top
C10  47.5,36.45 90 top
C11  35.79,23.8 90 top
C12  34.04,59.44 180 top
C14  37.34,9.65 270 top
C15  18.54,50.8 180 top
C16  42.16,63.75 180 top
C18  23.62,50.8 180 top
C19  37.59,66.55 0 top
C20  37.59,64.52 0 top
CONN1  59.26,7.04 0 top
CRO1  36.58,41.02 0 top
D1  38.86,15.49 180 top
ESP-07  12.45,62.23 90 top
GND  38.07,46.18 0 top
GND13  10.92,4.95 0 bottom
GND21  55.78,11.4 0 top
GND22  60.53,13.87 0 top
HD1  3.3,27.56 270 top
HD2  70.36,32.64 90 top
ICSP  26.42,21.59 90 top
J1  68.33,72.14 90 top
J2  68.33,55.63 90 top
J4  71.12,13.21 90 top
LDO1  40.89,7.37 0 top
LED1  39.62,20.83 270 top
LED3  56.39,28.57 270 top
LED4  56.39,26.16 90 top
LED5  56.39,23.75 90 top
MCU1  36.83,33.15 270 top
PB1  50.16,41.91 0 top
PTC1  57.91,18.92 180 top
R1  11.94,50.55 180 top
R2  7.11,50.55 0 top
R3  39.37,18.29 180 top
R4  44.96,35.94 270 top
R5  51.31,23.75 180 top
R6  51.31,26.16 180 top
R7  51.31,28.57 180 top
R8  61.01,10.95 270 top
R9  56.26,9.09 0 top
R10  34.8,18.29 0 top
R11  55.12,57.66 180 top
R12  3.56,73.41 0 top
R13  55.12,73.91 180 top
R14  55.12,71.12 180 top
R15  34.8,53.85 180 top
R16  39.62,53.85 0 top
SCL  46.2,45.92 0 top
SDA  48.74,47.19 180 top
SW1  47.5,7.75 90 top
TH1  42.42,66.8 0 top
TP1  32.77,66.29 180 top
U4  53.59,64.01 0 top
U$1  [GND0]  16.51,5.08 0 bottom
U$2  [GND0]  32.51,46.23 0 top
U$3  [SCL0]  41.02,45.97 0 top
U$4  [SDA0]  49.4,47.37 0 top
U$7  [CC10]  53.59,13.46 0 top
U$8  [CC20]  58.29,15.88 0 top
U$9  [ON0]  45.47,2.67 0 top
U$10  [OFF0]  45.21,12.83 0 top
U$11  [V1#0#00]  10.03,3.56 0 top
U$12  [AGRO0]  22.73,77.6 0 top
U$13  [V1#0#00]  18.41,76.71 0 bottom
U$14  [AGRO0]  51.56,77.6 0 bottom
U$17  [GND0]  64.77,15.88 0 top
U$18  [VIN0]  65.28,13.21 0 top
U$20  [KORTEX_BIG_01#PNG]  14.86,26.8 0 top
USBSC1  51.44,19.18 90 top
UV1  37.59,59.69 180 top

### Tracks (layer width: path | path; a pad name or v marks a point on that pad's centre or on a via)
+3V3  (via drill 0.35, 0.65, 0.85, 1)
  Top 0.305: v53.72,16.51 52.69,16.51 | 52.69,16.51 52.32,16.51 52.19,16.65 USBSC1.5 | 52.69,16.51 USBSC1.6 52.69,17.62 52.99,17.62 52.99,17.93 USBSC1.7 54.46,17.93 54.48,17.91 | MCU1.6 35.63,35.88 v35.31,35.56 36.96,35.56 37.23,35.83 MCU1.4 | v44.7,38.35 44.96,38.1 R4.1 | UV1.4 34.98,59.34 C12.1 | TH1.5 44.58,66.8 44.83,66.55 44.83,64.9 44.45,64.52 44.45,64.01 44.2,63.75 C16.1 | TP1.P$4 33.12,68.17 32.77,67.82 32.77,64.9 33.24,64.42 TP1.P$1
  Top 0.356: MCU1.18 34.83,31.34 34.8,31.37 v34.8,31.5
  Top 0.406: C5.1 47,16.37 47.12,16.26 v48.51,16.26 | LED4.A 58.67,26.16 58.93,25.91 58.93,24 58.67,23.75 LED5.A 57.44,21.68 57.66,21.46 57.66,17.65 57.4,17.4 55.88,17.4 55.37,17.91 54.48,17.91 | R13.2 53.09,73.91 52.83,73.66 52.83,71.37 | 52.83,71.37 53.09,71.12 R14.2 | U4.5 53.59,64.26 53.34,64.01 51.44,64.01 51.05,63.63 | 51.05,63.63 51.05,61.21 | 51.05,61.21 51.05,58.04 51.44,57.66 R11.2 | 51.05,61.21 v48.39,61.21 43.56,61.21 43.06,61.71 C16.1 | C12.1 34.89,64.33 34.8,64.42 | 51.05,63.63 51.05,70.87 51.56,71.37 52.83,71.37 | R15.2 33.85,57.85 33.78,57.91 | R16.2 42.55,53.85 42.93,54.23 v42.93,56.01
  Top 0.457: MCU1.18 34.83,27.88 35.17,27.55 35.17,26.41
  Top 0.508: R3.1 40.45,18.41 42.93,18.41 | C6.2 42.55,11.56 42.93,11.18 | C5.1 43.3,16.37 42.93,16 | v34.16,25.4 35.17,26.41 C7.1 | R2.2 R1.2 10.92,50.48 10.92,49.28 11.18,49.02 14.48,49.02 14.99,49.53 19.05,49.53 19.44,49.92 C15.1 | TP1.P$1 34.8,64.42 36.59,64.42 C20.1
  Top 0.61: LDO1.5 39.94,9.59 40.26,9.91 42.55,9.91 42.93,10.29 42.93,11.18
  Top 0.635: 20.57,47.75 20.57,50.55 | 20.57,50.55 20.57,54.01 ESP-07.VCC | 20.57,50.55 20.32,50.8 C15.1 | 20.57,50.55 20.83,50.8 C18.+
  Top 0.762: 31.75,57.91 33.78,57.91 34.29,57.91 34.89,58.51 C12.1
  Top 0.889: v29.97,57.91 31.75,57.91
  Top 1.143: 42.93,11.18 42.93,16 42.93,18.41 42.93,22.48 41.78,23.62 v38.48,23.62 | v22.86,47.75 20.57,47.75 15.95,47.75 +3.3V.T
  Bottom 0.305: 49.53,16.26 50.04,16.26 50.37,15.93 54.91,15.93 55.07,16.08 55.07,16.38 54.94,16.51 v53.72,16.51 | v44.7,38.35 43.66,38.35 43.35,38.05 43.35,36.17 42.95,35.76 41.63,35.76 40.31,34.44 40.31,34.01 39.62,33.33 34.8,33.33
  Bottom 0.356: v34.8,31.5 34.8,33.33 34.8,35.05 v35.31,35.56
  Bottom 0.406: v48.51,16.26 49.53,16.26 | v42.93,56.01 42.93,57.78 42.8,57.91
  Bottom 0.508: 34.16,23.62 34.16,23.98 33.83,24.31 33.83,25.07 v34.16,25.4
  Bottom 0.635: 28.96,26.42 21.21,26.42 20.45,25.65 20.45,9.4 19.56,8.51 HD1.32 HD1.31
  Bottom 0.762: v29.97,57.91 42.8,57.91 47.62,57.91 48.39,58.67 v48.39,61.21
  Bottom 1.143: v38.48,23.62 34.16,23.62 33.53,22.99 31.62,22.99 30.99,23.62 30.99,24.89 30.48,25.4 29.97,25.4 28.96,26.42 28.96,46.74 | 28.96,46.74 27.94,47.75 v22.86,47.75 | 28.96,46.74 28.96,56.9 v29.97,57.91
A0  (via drill 0.35)
  Top 0.305: MCU1.23 39.05,28.64 39.05,28 39.56,27.48 43.23,27.48 44.33,26.39 46.18,26.39 46.96,25.61 47.91,25.61 48.82,26.51 48.82,27.51 v48.64,27.69 49.37,27.69 49.58,27.47 58.08,27.47 59.44,26.12 59.44,21.01 59.74,20.7 67.18,20.7 67.97,19.91 69.06,19.91 HD2.2 HD2.1
A1  (via drill 0.35)
  Top 0.305: MCU1.24 39.63,28.06 39.75,27.94 42.55,27.94 43.03,28.42 v43.03,29.59 | v57.58,30.15 57.73,30 58.55,30 58.55,27.69 59.94,26.29 59.94,21.59 60.2,21.34 67.94,21.34 HD2.4 HD2.3
  Bottom 0.305: v43.03,29.59 43.59,29.59 43.89,29.29 46.17,29.29 46.72,29.84 48.97,29.84 49.66,29.16 54.08,29.16 54.53,29.62 54.53,30.23 55.22,30.91 55.78,30.91 56.19,30.5 57.23,30.5 v57.58,30.15
A2  (via drill 0.35)
  Top 0.305: MCU1.25 42.37,30.35 v42.39,30.33 | v59.44,29.97 59.44,29.21 59.05,28.83 59.05,27.82 60.4,26.48 60.4,25.4 60.78,25.02 HD2.6 HD2.5
  Bottom 0.305: v42.39,30.33 42.75,30.33 42.77,30.3 43.52,30.3 44.08,29.74 45.98,29.74 46.53,30.3 49.2,30.3 49.89,29.62 53.87,29.62 54.08,29.82 54.08,30.42 55.03,31.37 55.97,31.37 56.38,30.96 57.73,30.96 58.09,30.61 59.05,30.61 59.44,30.23 v59.44,29.97
A3  (via drill 0.35)
  Top 0.305: v43.05,30.99 42.89,31.15 42.66,31.15 42.65,31.14 42.09,31.14 42.08,31.15 MCU1.26 | v58.67,31.37 59.39,30.66 59.72,30.66 60.12,30.25 60.12,29.25 59.56,28.69 59.56,28.07 60.07,27.56 HD2.8 HD2.7
  Bottom 0.305: v43.05,30.99 43.28,30.76 43.71,30.76 44.27,30.2 45.79,30.2 46.34,30.76 49.39,30.76 50.08,30.07 53.31,30.07 53.62,30.38 53.62,30.61 54.84,31.82 56.16,31.82 56.56,31.42 58.62,31.42 v58.67,31.37
A4SDA  (via drill 0.35)
  Top 0.305: v57.76,33.38 57.78,33.38 58.06,33.66 58.55,33.66 59.13,34.24 64.95,34.24 HD2.10 HD2.9 | v42.36,31.83 42.24,31.95 MCU1.27 | v46.74,38.61 46.74,38.86 46.23,39.37 46.23,44.45 47.24,45.47 48.26,45.47 48.74,45.95 SDA.T 48.74,48.54 48.01,49.28 39.37,49.28 38.61,50.04 38.67,50.1 R16.1 38.67,55.44 39.12,55.88 40.64,55.88 40.89,56.13 40.89,59.18 | 40.89,59.18 40.89,59.69 40.54,60.04 39.75,60.04 | 39.75,60.04 UV1.2 | TP1.P$7 29.98,65.67 29.72,65.41 29.72,63.25 29.97,62.99 29.97,61.21 30.35,60.83 v31.75,60.83 | v41.78,59.18 40.89,59.18 | TH1.1 39.99,67.8 39.75,67.56 39.75,60.04
  Bottom 0.305: 46.1,33.43 46.1,33.06 44.87,31.83 v42.36,31.83 | 46.1,33.43 46.1,37.59 46.74,38.23 v46.74,38.61 | v57.76,33.38 46.15,33.38 46.1,33.43 | v41.78,59.18 41.78,60.58 41.53,60.83 v31.75,60.83
A5SCL  (via drill 0.35)
  Top 0.305: MCU1.28 41.12,32.77 42.71,32.77 v42.82,32.66 | v58.27,34.34 58.37,34.44 58.52,34.44 58.8,34.72 66.17,34.72 68.25,32.64 HD2.12 HD2.11 | v45.72,38.48 45.72,45.44 SCL.T 46.2,47.78 45.72,48.26 36.58,48.26 36.07,48.77 36.07,53.53 R15.1 35.75,56.2 36.07,56.52 37.34,56.52 37.59,56.77 37.59,59.94 | TP1.P$8 32.1,64.42 32.51,64.01 v32.51,61.85 | v38.48,61.59 37.85,61.59 37.59,61.34 37.59,59.94 | UV1.3 37.5,60.04 37.59,59.94 | v44.32,62.74 45.34,63.75 45.34,67.44 44.97,67.8 TH1.6
  Bottom 0.305: v42.82,32.66 43.01,32.84 45.24,32.84 45.64,33.24 45.64,38.4 v45.72,38.48 45.72,40.23 46.18,40.69 47.14,40.69 47.65,40.18 47.65,38.25 46.69,37.29 46.69,34.14 46.99,33.83 57.25,33.83 57.76,34.34 v58.27,34.34 | v32.51,61.85 32.77,61.59 v38.48,61.59 43.94,61.59 44.32,61.98 v44.32,62.74
A6  (via drill 0.35)
  Top 0.305: v55.5,30.23 56.39,30.23 56.77,30.61 56.77,34.67 57.28,35.18 HD2.14 HD2.13 | MCU1.19 35.63,29.79 35.94,30.1 36.96,30.1 37.21,30.35 v39.24,30.35
  Bottom 0.305: v55.5,30.23 54.99,29.72 54.99,29.34 54.36,28.7 49.4,28.7 48.72,29.39 48.1,29.39 48.06,29.34 46.86,29.34 46.35,28.83 41.91,28.83 41.4,29.34 41.4,30.1 41.15,30.35 v39.24,30.35
A7  (via drill 0.35)
  Top 0.305: MCU1.22 38.03,27.76 38.76,27.03 43.04,27.03 43.81,26.25 43.81,19.56 44.32,19.05 46.79,19.05 47.55,18.29 v47.55,17.78 | v59.74,36.58 59.74,37.44 60.05,37.74 69.06,37.74 HD2.16 HD2.15
  Bottom 0.305: v47.55,17.78 54.51,17.78 54.91,18.19 54.91,21.69 55.63,22.4 57.76,22.4 57.96,22.61 57.96,28.85 58.4,29.29 59.72,29.29 60.12,29.69 60.12,30.25 59.38,30.99 59.38,36.22 v59.74,36.58
AREF
  Top 0.305: HD1.29 HD1.30 9.65,11.05 10.54,11.94 10.54,18.54 11.43,19.43 22.54,19.43 22.63,19.34 22.83,19.14 23.22,18.75 30.33,18.75 30.89,19.3 30.89,20.65 34.16,23.93 35.02,23.93 C11.2 35.79,25.5 36.09,25.81 36.09,27.66 36.43,28 MCU1.20
CAP1
  Top 0.406: TP1.P$2 35.44,65.67 35.81,66.04 35.81,66.29 36.07,66.55 C19.1
CC1
  Top 0.305: CONN1.A5 58.01,8.79 57.71,9.09 R9.2 57.11,10.12 56.79,10.44 56.03,10.44 55.78,10.69 GND21.T
CC2
  Top 0.305: CONN1.B5 R8.2 61.61,10.1 61.95,10.44 61.95,13.49 61.57,13.87 GND22.T
D2-RXD  (via drill 0.35, 0.4)
  Top 0.305: HD1.5 HD1.6 6.86,39.24 6.86,37.59 9.14,35.31 23.75,35.31 24.31,35.87 24.31,36.51 25.05,37.26 26.06,37.26 26.46,36.86 26.46,36.53 26.67,36.32 26.92,36.32 27.18,36.58 v27.3,36.58 | MCU1.32 42.42,35.95 42.67,36.2 v42.67,36.45 | v30.23,38.61 29.54,39.29 27.74,39.29 v27.43,38.99
  Top 0.406: v8.64,63.25 8.64,70.42 ESP-07.RX
  Bottom 0.305: v42.67,36.45 39.93,36.45 39.07,35.59 39.07,35.35 38.95,35.22 37.17,35.22 36.9,35.49 36.9,36.22 35.97,37.16 34.64,37.16 34.09,36.6 31.73,36.6 31.45,36.88 31.45,37.27 31.11,37.6 31.11,38.1 30.61,38.61 v30.23,38.61 | v27.3,36.58 26.8,36.58 26.24,37.13 26.24,38.56 26.54,38.86 27.3,38.86 v27.43,38.99
  Bottom 0.406: HD1.6 7.75,41.53 8.64,42.42 v8.64,63.25
D3-TXD  (via drill 0.35, 0.4)
  Top 0.305: HD1.7 4.32,38.99 HD1.8 8.89,34.67 24,34.67 24.77,35.43 24.77,36.32 25.02,36.58 v25.78,36.58 | MCU1.1 39.63,38.23 39.75,38.35 40.26,38.35 40.51,38.1 40.51,37.72 40.77,37.47 41.78,37.47 v42.04,37.21 | v26.8,39.75 30.1,39.75 v30.23,39.62
  Top 0.406: v6.6,66.8 6.6,70.57 6.65,70.61
  Top 0.508: R12.2 6.1,73.41 6.65,72.86 6.65,70.61 ESP-07.TX
  Bottom 0.305: v42.04,37.21 41.73,36.91 39.74,36.91 38.51,35.68 37.72,35.68 37.36,36.04 37.36,36.41 36.16,37.62 34.45,37.62 33.9,37.06 32.03,37.06 31.9,37.19 31.9,37.46 31.57,37.79 31.57,38.29 v30.24,39.62 v30.23,39.62 | v25.78,36.58 25.78,39.37 26.16,39.75 v26.8,39.75
  Bottom 0.406: HD1.8 8.76,38.99 9.91,40.13 9.91,64.01 9.14,64.77 7.37,64.77 6.6,65.53 v6.6,66.8
D4
  Top 0.254: 33.3,36.53 33.33,36.5 33.46,36.5 33.63,36.34 33.63,36.2 34.95,34.88
  Top 0.305: 34.95,34.88 35.59,34.88 35.81,35.1 38.41,35.1 38.86,35.56 38.83,35.59 MCU1.2 | HD1.9 HD1.10 6.99,34.04 25.32,34.04 26.34,35.05 28.45,35.05 29.08,35.69 30.61,35.69 31.45,36.53 33.3,36.53
D5
  Top 0.305: HD1.11 HD1.12 6.22,33.91 6.73,33.4 25.53,33.4 26.67,34.54 28.7,34.54 29.34,35.18 30.86,35.18 31.63,35.95 MCU1.9
D6
  Top 0.305: HD1.13 HD1.14 5.71,31.37 7.11,32.77 25.78,32.77 27.05,34.04 28.96,34.04 29.59,34.67 31.24,34.67 31.72,35.15 MCU1.10
D7
  Top 0.305: HD1.15 HD1.16 7.87,32.13 26.04,32.13 27.43,33.53 29.21,33.53 29.84,34.16 31.5,34.16 31.68,34.35 MCU1.11
D8
  Top 0.305: HD1.17 HD1.18 9.78,31.5 26.29,31.5 27.81,33.02 29.59,33.02 30.12,33.55 MCU1.12
D9
  Top 0.305: HD1.19 HD1.20 6.6,25.78 6.6,27.43 10.03,30.86 26.54,30.86 28.19,32.51 30.48,32.51 30.71,32.75 MCU1.13
D10
  Top 0.305: HD1.21 HD1.22 5.33,21.97 17.91,21.97 18.67,22.73 21.34,22.73 21.72,23.11 21.72,24 22.23,24.51 25.15,24.51 26.29,25.65 28.83,25.65 29.21,26.04 29.21,31.11 30.04,31.95 MCU1.14
D+  (via drill 0.35)
  Top 0.305: USBSC1.3 51.19,15.44 arc80 51.66,14.96 56.59,14.96 arc-90 57.61,13.95 v57.61,11.15 | CONN1.A6 59.01,5.96 arc80 59.26,5.71 59.77,5.71 arc80 60.01,5.96 CONN1.B6 60.01,8.85 59.38,9.47 v59.38,10.16
  Bottom 0.305: v59.38,10.16 59.38,10.46 arc80 59.05,10.79 57.96,10.79 arc-80 v57.61,11.15
D-
  Top 0.305: USBSC1.4 51.69,16.01 arc80 51.94,15.75 57.4,15.75 arc-80 58.51,14.64 58.51,12.87 58.51,12.7 58.51,8.89 | CONN1.B7 58.51,8.89 | CONN1.A7 59.51,8.56 59.18,8.89 58.51,8.89
DTR  (via drill 0.35)
  Top 0.305: USBSC1.23 48.63,18.43 48.26,18.8 v48.13,18.8 | v47.37,28.19 47.37,35.42 C10.1
  Bottom 0.305: v48.13,18.8 47.77,19.15 47.62,19.15 47.22,19.56 47.22,25.35 46.56,26.01 46.56,26.57 47.37,27.38 v47.37,28.19
GND  (via drill 0.35)  (1 unrouted)
  Top 0.305: USBSC1.2 50.69,18.43 USBSC1.THERM | MCU1.21 37.23,26.93 C7.2 | C4.2 45.97,20.57 45.85,20.7 v44.7,20.7 | v44.2,18.03 45.84,18.03 C5.2
  Bottom 0.305: v44.7,20.7 44.2,20.19 v44.2,18.03
  other vias: 43.47,43.87 62.36,22.35 61.34,26.8 7.11,17.53 60.45,32.05 53.04,36.22 22.35,28.83 37.34,51.44 37.47,68.33
  pour Top (isolate 0, rank 2): -1.27,82.55 -1.27,-1.27 0,-1.27 74.93,-1.27 74.93,83.82 -1.27,83.82
  pour Bottom (rank 2): -1.52,84.33 -1.52,-1.52 76.71,-1.52 76.71,84.33
GPIO/0
  Top 0.305: R6.2 49.15,26.16 48.9,25.91 48.9,22.35 49.06,22.18 49.62,22.18 49.77,22.34 51.1,22.34 51.56,21.88 51.91,21.88 52.19,21.61 USBSC1.14
GPIO/1
  Top 0.305: R5.2 50.36,23.5 51.07,22.8 51.29,22.8 51.75,22.34 52.1,22.34 52.69,21.75 USBSC1.13
LDO_INPUT  (via drill 0.4)
  Top 0.508: C3.2 39.63,5.09 | 39.63,5.09 40.01,5.46 39.94,5.52 LDO1.1 | 39.63,5.09 40.15,4.57 42.67,4.57 43.31,5.21 44.63,5.21 45.47,5.21 47.37,3.3 56.13,3.3 56.64,2.79 61.47,2.79 62.48,3.81 66.04,3.81 66.93,4.7 66.93,12.57 67.56,13.21 J4.1 | D1.C 40.71,14.17 40.26,13.72 35.43,13.72 34.8,13.08 34.8,11.94 | 34.8,11.94 34.8,8.76 35.31,8.25 C14.+ | v31.62,11.94 34.8,11.94
  Top 0.61: 44.63,5.21 SW1.1 | C3.2 C14.+
  Bottom 0.508: ICSP.2 25.2,21.54 26.92,21.54 27.69,20.77 27.69,12.57 28.32,11.94 v31.62,11.94
MISO
  Top 0.305: HD1.25 HD1.26 6.99,18.54 8.51,18.54 10.67,20.7 18.54,20.7 19.3,21.46 21.75,21.46 22.92,20.3 22.94,20.32 ICSP.1 24.26,20.32 25.53,21.59 26.92,21.59 27.69,22.35 27.69,23.88 28.19,24.38 29.97,24.38 30.73,25.15 30.73,30.1 30.98,30.35 MCU1.16
MOSI
  Top 0.305: HD1.23 HD1.24 6.66,20.75 9.7,20.75 10.29,21.34 18.16,21.34 18.92,22.1 22.23,22.1 22.89,21.44 24.35,21.44 25.11,22.2 25.76,22.2 ICSP.4 26.42,24.51 26.92,25.02 29.59,25.02 29.97,25.4 29.97,30.61 30.51,31.15 MCU1.15
N$1
  Top 0.406: LED3.A R7.1
N$2
  Top 0.508: LED1.A 38.42,20.67 R3.2
N$3
  Top 0.508: R1.1 12.89,51.63 12.45,52.07 11.18,52.07 10.65,52.6 ESP-07.CH_PD
N$4  (via drill 0.35)
  other vias: 38.63,31.55
N$5
  Top 0.406: LED4.C R6.1
N$6
  Top 0.305: C9.2 34.6,39.99 | 34.6,39.99 CRO1.1 | MCU1.8 34.03,38.48 34.6,39.05 34.6,39.99
N$7
  Top 0.305: C8.2 38.55,42.05 | 38.55,42.05 CRO1.3 | MCU1.7 34.83,38.39 35.18,38.73 35.94,38.73 36.2,38.99 36.2,40.39 37.86,42.05 38.55,42.05
N$8
  Top 0.406: LED5.C R5.1
N$10
  Top 0.508: R2.1 6.16,51.88 6.65,52.37 ESP-07.REST
N$13
  Top 0.305: C4.1 49.81,21.73 49.96,21.88 50.91,21.88 51.19,21.61 USBSC1.16
N$16
  Top 0.508: LDO1.3 41.84,6.92 42.16,7.24 42.8,7.24 43.31,7.75 SW1.2
RAINFALL
  Top 0.406: U4.3 54.54,60.01 54.86,59.69 55.63,59.69 | 55.63,59.69 56.13,59.18 56.13,57.82 R11.1 C1.1 | J2.4 64.64,56.26 65.28,56.9 65.28,59.94 64.52,60.71 56.64,60.71 55.63,59.69
RESET  (via drill 0.35)
  Top 0.305: 44.99,34.96 45.02,34.92 46.1,34.92 46.35,35.18 46.35,37.08 46.62,37.35 C10.2 47.75,37.6 47.75,38.86 47.88,38.99 48.64,38.99 48.9,39.24 48.9,42.42 48.64,42.67 47.88,42.67 47.62,42.93 PB1.1 | 44.99,34.96 R4.2 | v44.96,33.53 44.99,33.56 44.99,34.96 | ICSP.5 32.26,23.62 32.64,23.62 32.9,23.88 v32.9,24.25 | v35.56,30.73 36.7,30.73 37.08,31.11 37.08,33.27 37.36,33.55 40.87,33.55 MCU1.29 42.39,33.55 v42.47,33.63
  Bottom 0.305: v42.47,33.63 43.08,33.63 43.31,33.4 44.83,33.4 v44.96,33.53 | v32.9,24.25 32.9,30.1 33.53,30.73 v35.56,30.73
RXD  (via drill 0.35)
  Top 0.305: USBSC1.21 48.52,19.43 48.11,19.84 v47.9,19.84 | v47.24,26.29 47.24,26.54 46.94,26.85 44.52,26.85 43.87,27.5 43.87,33.01 43.82,33.06 43.82,33.46 42.93,34.35 MCU1.30 41.01,34.29 v39.62,34.29 | v30.23,36.58 30.23,36.63 30.91,37.31 30.91,39.91 30.38,40.43 26.51,40.43 26.11,40.03 26.11,38.69 25.78,38.35 24.66,38.35 22.89,36.58 9.65,36.58 8,38.23 8,43.18 HD1.2 HD1.1
  Bottom 0.305: v47.9,19.84 47.9,20.69 47.68,20.92 47.68,25.86 v47.24,26.29 | v39.62,34.29 36.58,34.29 35.99,34.88 35.99,35.84 35.59,36.24 35.02,36.24 34.47,35.69 30.61,35.69 30.23,36.07 v30.23,36.58
SCK  (via drill 0.35)
  Top 0.305: ICSP.3 27.84,21.74 29.42,21.74 34.03,26.35 MCU1.17 34.03,31.8 34.57,32.33 35.36,32.33 v35.81,31.88 | HD1.27 HD1.28 6.48,11.68 9.27,11.68 9.91,12.32 9.91,19.05 10.92,20.07 18.92,20.07 19.3,20.45 v21.59,20.45 | v48.39,28.7 50.23,28.7 R7.2
  Bottom 0.305: v35.81,31.88 36.7,30.99 36.7,28.7 37.08,28.32 46.53,28.32 47.09,28.88 47.65,28.88 47.83,28.7 v48.39,28.7 | ICSP.3 26.42,19.18 26.04,18.8 22.86,18.8 22.23,19.43 22.23,19.81 v21.59,20.45
TXD  (via drill 0.35)
  Top 0.305: USBSC1.20 48.78,19.93 48.51,20.19 v48.51,21.05 | v48.13,26.8 47.62,27.3 44.7,27.3 44.32,27.69 44.32,33.2 44.27,33.24 44.27,33.65 42.78,35.15 MCU1.31 40.16,35.15 40.01,35.31 v39.75,35.31 | v27.85,35.84 27.85,36.16 27.99,36.29 27.99,36.86 27.59,37.26 26.88,37.26 26.29,37.85 24.89,37.85 23.75,36.7 23.75,36.2 23.5,35.94 9.4,35.94 7.37,37.97 7.37,39.5 5.97,40.89 5.97,42.67 HD1.4 HD1.3 | v27.3,38.08 29.74,38.08 v30.23,37.59
  Bottom 0.305: v48.51,21.05 48.51,21.97 48.13,22.35 v48.13,26.8 | v39.75,35.31 39.42,34.97 39.34,34.97 39.12,34.75 36.77,34.75 36.45,35.07 36.45,36.03 35.78,36.7 34.83,36.7 34.28,36.14 31.29,36.14 30.99,36.45 30.99,37.08 30.48,37.59 v30.23,37.59 | v27.85,35.84 27.85,36.16 27.99,36.29 27.99,36.86 27.59,37.26 27.18,37.26 27.18,37.95 v27.3,38.08
VBUS_01  (via drill 0.35)
  Top 0.305: PTC1.2 56.02,18.43 USBSC1.8
  Top 0.508: PTC1.2 56.51,20.82 56.52,20.83 v56.52,21.08 | v38.48,15.37 38.35,15.49 37.08,15.49 | 37.08,15.49 D1.A | R10.2 35.75,17.08 36.07,16.76 36.58,16.76 37.08,16.26 37.08,15.49
  Bottom 0.508: v56.52,21.08 56.52,21.46 56.26,21.72 55.88,21.72 55.63,21.46 55.63,15.62 55.37,15.37 v38.48,15.37
WIND_DIR  (via drill 0.35)
  Top 0.406: J1.5 56.09,74.04 R13.1 55.97,72.73 v55.88,72.64 | U4.6 52.64,67.12 53.09,67.56 v53.59,67.56
  Bottom 0.406: v55.88,72.64 55.88,67.82 55.63,67.56 v53.59,67.56
WIND_SPEED
  Top 0.406: C2.1 57.15,69.09 57.4,69.34 | 57.4,69.34 57.4,70.87 57.15,71.12 R14.1 | J1.4 63.37,72.77 64.01,72.14 64.01,67.31 63.75,67.06 57.66,67.06 57.4,67.31 | 57.4,67.31 57.4,69.34 | 57.4,67.31 54.86,67.31 54.54,66.99 U4.4
XVBUS
  Top 0.406: CONN1.VBUS1 56.81,6.16 57.15,5.82 57.15,5.03 57.61,4.57 61.09,4.57 61.42,4.9 61.42,5.92 61.71,6.21 CONN1.VBUS2
  Top 0.508: PTC1.1 61.82,18.92 62.71,18.04 62.71,9.37 61.71,8.37 CONN1.VBUS2

### Text on the board
tPlace: Kortex | D0/RXD | GND | D1/TXD | GND | D2 | GND | RESET | D3 | A7 | D4 | A6 | D5 | A5 | D6 | A4 | D7 | SCK | A3 | D8 | TX | G | A2 | D9 | RX | A1 | D10 | ON | A0 | MISO | MOSI | SCK | AREF | 3.3V | 4/22/2019
bPlace: Amine Mehdi Mansouri | 4/22/2019 | Kortex